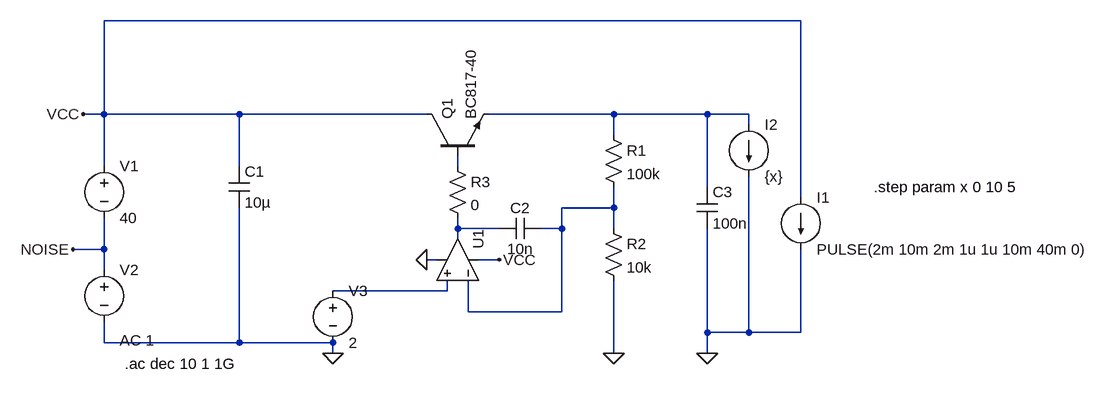
[diagram p0: schematic DET_PSU.asc]
DET_PSU.asc, the LTspice schematic file:
Version 4
SHEET 1 1616 680
WIRE 1104 -128 32 -128
WIRE 32 16 32 -128
WIRE 32 16 0 16
WIRE 240 16 32 16
WIRE 528 16 240 16
WIRE 816 16 624 16
WIRE 960 16 816 16
WIRE 1024 16 960 16
WIRE 1024 32 1024 16
WIRE 816 48 816 16
WIRE 32 96 32 16
WIRE 240 96 240 16
WIRE 576 96 576 80
WIRE 960 128 960 16
WIRE 1104 144 1104 -128
WIRE 816 160 816 128
WIRE 816 160 736 160
WIRE 576 192 576 176
WIRE 640 192 576 192
WIRE 736 192 736 160
WIRE 736 192 704 192
WIRE 816 192 816 160
WIRE 576 208 576 192
WIRE 32 224 32 176
WIRE 32 224 -16 224
WIRE 544 240 528 240
WIRE 640 240 608 240
WIRE 32 256 32 224
WIRE 560 288 560 272
WIRE 560 288 384 288
WIRE 592 320 592 272
WIRE 736 320 736 192
WIRE 736 320 592 320
WIRE 960 352 960 192
WIRE 1024 352 1024 112
WIRE 1024 352 960 352
WIRE 1104 352 1104 224
WIRE 1104 352 1024 352
WIRE 32 368 32 336
WIRE 240 368 240 160
WIRE 240 368 32 368
WIRE 384 368 240 368
WIRE 384 384 384 368
WIRE 816 384 816 272
WIRE 960 384 960 352
FLAG 816 384 0
FLAG 384 384 0
FLAG 0 16 VCC
FLAG 960 384 0
FLAG 640 240 VCC
FLAG 528 240 0
FLAG -16 224 NOISE
DATAFLAG 816 16 ""
SYMBOL voltage 32 80 R0
WINDOW 123 0 0 Left 0
WINDOW 39 0 0 Left 0
SYMATTR InstName V1
SYMATTR Value 40
SYMBOL voltage 32 240 R0
WINDOW 123 24 124 Left 2
WINDOW 39 0 0 Left 0
SYMATTR Value2 AC 1
SYMATTR InstName V2
SYMATTR Value ""
SYMBOL cap 224 96 R0
SYMATTR InstName C1
SYMATTR Value 10µ
SYMBOL npn 528 80 R270
SYMATTR InstName Q1
SYMATTR Value BC817-40
SYMBOL res 800 32 R0
SYMATTR InstName R1
SYMATTR Value 100k
SYMBOL res 800 176 R0
SYMATTR InstName R2
SYMATTR Value 10k
SYMBOL res 560 80 R0
SYMATTR InstName R3
SYMATTR Value 0
SYMBOL cap 704 176 R90
WINDOW 0 0 32 VBottom 2
WINDOW 3 32 32 VTop 2
SYMATTR InstName C2
SYMATTR Value 10n
SYMBOL voltage 384 272 R0
WINDOW 123 0 0 Left 0
WINDOW 39 0 0 Left 0
SYMATTR InstName V3
SYMATTR Value 2
SYMBOL cap 944 128 R0
SYMATTR InstName C3
SYMATTR Value 100n
SYMBOL OpAmps\\UniversalOpAmp 576 240 M270
SYMATTR InstName U1
SYMBOL current 1104 144 R0
WINDOW 123 0 0 Left 0
WINDOW 39 0 0 Left 0
SYMATTR InstName I1
SYMATTR Value PULSE(2m 10m 2m 1u 1u 10m 40m 0)
SYMBOL current 1024 32 R0
WINDOW 123 0 0 Left 0
WINDOW 39 0 0 Left 0
SYMATTR InstName I2
SYMATTR Value {x}
TEXT 64 400 Left 2 !.ac dec 10 1 1G
TEXT 1216 128 Left 2 !.step param x 0 10 5

The netlist it stands for:
* DET_PSU.asc
V1 VCC NOISE 40
V2 NOISE 0 AC 1
C1 VCC 0 10µ
Q1 VCC N002 N001 0 BC817-40
R1 N001 N003 100k
R2 N003 0 10k
R3 N002 N004 0
C2 N003 N004 10n
V3 N005 0 2
C3 N001 0 100n
XU1 N005 N003 VCC 0 N004 level1 Avol=1Meg GBW=10Meg Vos=0 En=0 Enk=0 In=0 Ink=0 Rin=500Meg  ; pins In+ In- V+ V- OUT
I1 VCC 0 PULSE(2m 10m 2m 1u 1u 10m 40m 0)
I2 N001 0 {x}
.model NPN NPN
.model PNP PNP
.lib standard.bjt
.ac dec 10 1 1G
.step param x 0 10 5
.lib UniversalOpAmp1.lib
.backanno
.end